# Altium schematic sheet 3 amplifier.SchDoc: 音频功放
size A4; DrawnBy: 蒋朝晖; PageSetup: Record=PageOptions|CenterHorizontal=True|CenterVertical=True|PrintScale=0.98|XCorrection=1.00|YCorrection=1.00|PrintKind=1|BorderSize=5000000|LeftOffset=0|BottomOffset=0|Orientation=2|PaperLength=2970|PaperWidth=2100|Scale=100|PaperSource=261|PrintQuality=-3|MediaType=1|DitherType=10|PrintScaleMode=1|PaperKind=A4 210 x 297 毫米¦PaperIndex=9; Time: 2018-10-20
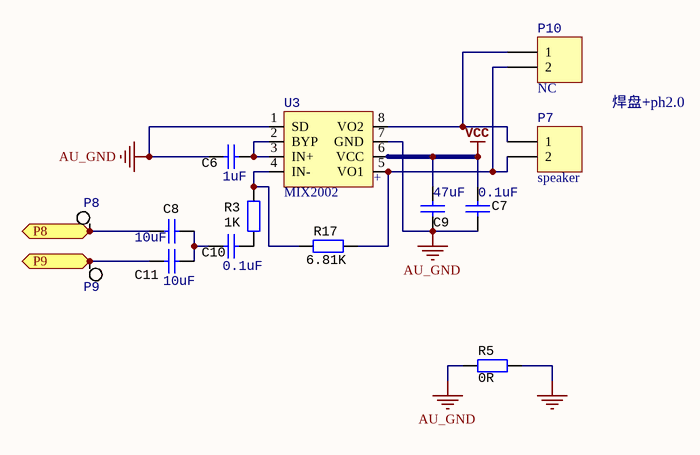
[diagram p0: 3 amplifier.SchDoc]

## Parts
C6  1uF  [0402]
C7  0.1uF  [0402]
C8  10uF  [0603]
C9  47uF  [0805]
C10  0.1uF  [0402]
C11  10uF  [0603]
P7  speaker  [焊盘]
P8  (no value)  [测试点]
P9  (no value)  [测试点]
P10  NC  [2PIN/2.0MM座子]
R3  1K  [0402]
R5  0R  [0402]
R17  6.81K  [0402]
U3  MIX2002  [SOP-8]

## Ports
P8 (bidir), P9 (bidir)

## Nets
AU_GND: C6.1 C7.2 C9.2 R5.2 U3.1(SD) U3.7(GND)
VCC: C7.1 C9.1 U3.6(VCC)
P8: C8.2 P8.1 ; port P8
P9: C11.2 P9.1 ; port P9
NetC6_2: C6.2 U3.2(BYP) U3.3(IN+)
NetC8_1: C8.1 C10.1 C11.1
NetC10_2: C10.2 R3.1
NetP7_1: P7.1 P10.1 U3.8(VO2)
NetP7_2: P7.2 P10.2 R17.2 U3.5(VO1)
NetR3_2: R3.2 R17.1 U3.4(IN-)

Not connected (* = marked no-connect by the designer): R5 1

## Notes on the sheet
- 焊盘+ph2.0
- (near U3) +

## Library data of the parts
C6-C11 = CAP1_npol: CAP, CERM, 0.01uF, 100V, +/-5%, X7R, 0603; PartNumber: 06031C103JAT2A; Manufacturer: AVX; Polarized: N; Tolerance: 5; ESR_Ohm: 0.098; Voltage Rating DC: 25V; RoHS Compliant: Y; MountType: SMT; Dielectric: X7R; ComponentLink1URL: http://www.avx.com/docs/masterpubs/smccp.pdf; Operating Temperature: -55+125C; PackageReference: 0603
  C6: Value: 1uF
  C7 C10: Value: 0.1uF
  C8 C11: Value: 10uF
  C9: Value: 47uF
P7 P10 = Header 2: Header, 2-Pin; LatestRevisionDate: 17-Jul-2002; LatestRevisionNote: Re-released for DXP Platform.; Publisher: Altium Limited; 封装链接: https://item.taobao.com/item.htm?spm=a230r.1.14.27.3Tbh4z&id=540251210643&ns=1&abbucket=11#detail
P8 P9 = TP: Test Point
R3 R5 R17 = RES1: RES, 1.0k ohm, 5%, 0.1W, 0603; PartNumber: RC0603JR-071KL; Manufacturer: Yageo America; CompType: Resistor; Res_ohm: 1000; Value_Code: 1k00; Tolerance_%: 5; Power_W: 0.1; VDC_V: 50; TempCo: 100 ppm/C; EIA_Code: E24; U/M: EA; SymbolVersion: 2009-05-29; RoHS: Y; Value1: 5%; Value2: 0.1W; MountType: SMT; Technology: Thick Film; Published: 2008-06-26; Publisher: Texas Instruments; LatestRevisionDate: 2014-04-18; ComponentLink1Description: Datasheet link; ComponentLink1URL: http://www.yageo.com/pdf/Pu-RC0603_51_PbFree_L_2.pdf; Supplier Part Number 1: 311-1.0KGRCT-ND; Supplier 2: Mouser; Supplier Part Number 2: 603-RC0603JR-071KL; Supplier 3: Farnell; Supplier Part Number 3: 9233385; PackageReference: 0603
  R3: Value: 1K
  R5: Value: 0R
  R17: Value: 6.81K
U3 = MIX2002: 名称: MIX2002